# Altium schematic sheet Board-Power.SchDoc
size A3; SheetNumber: 7; SheetTotal: 9
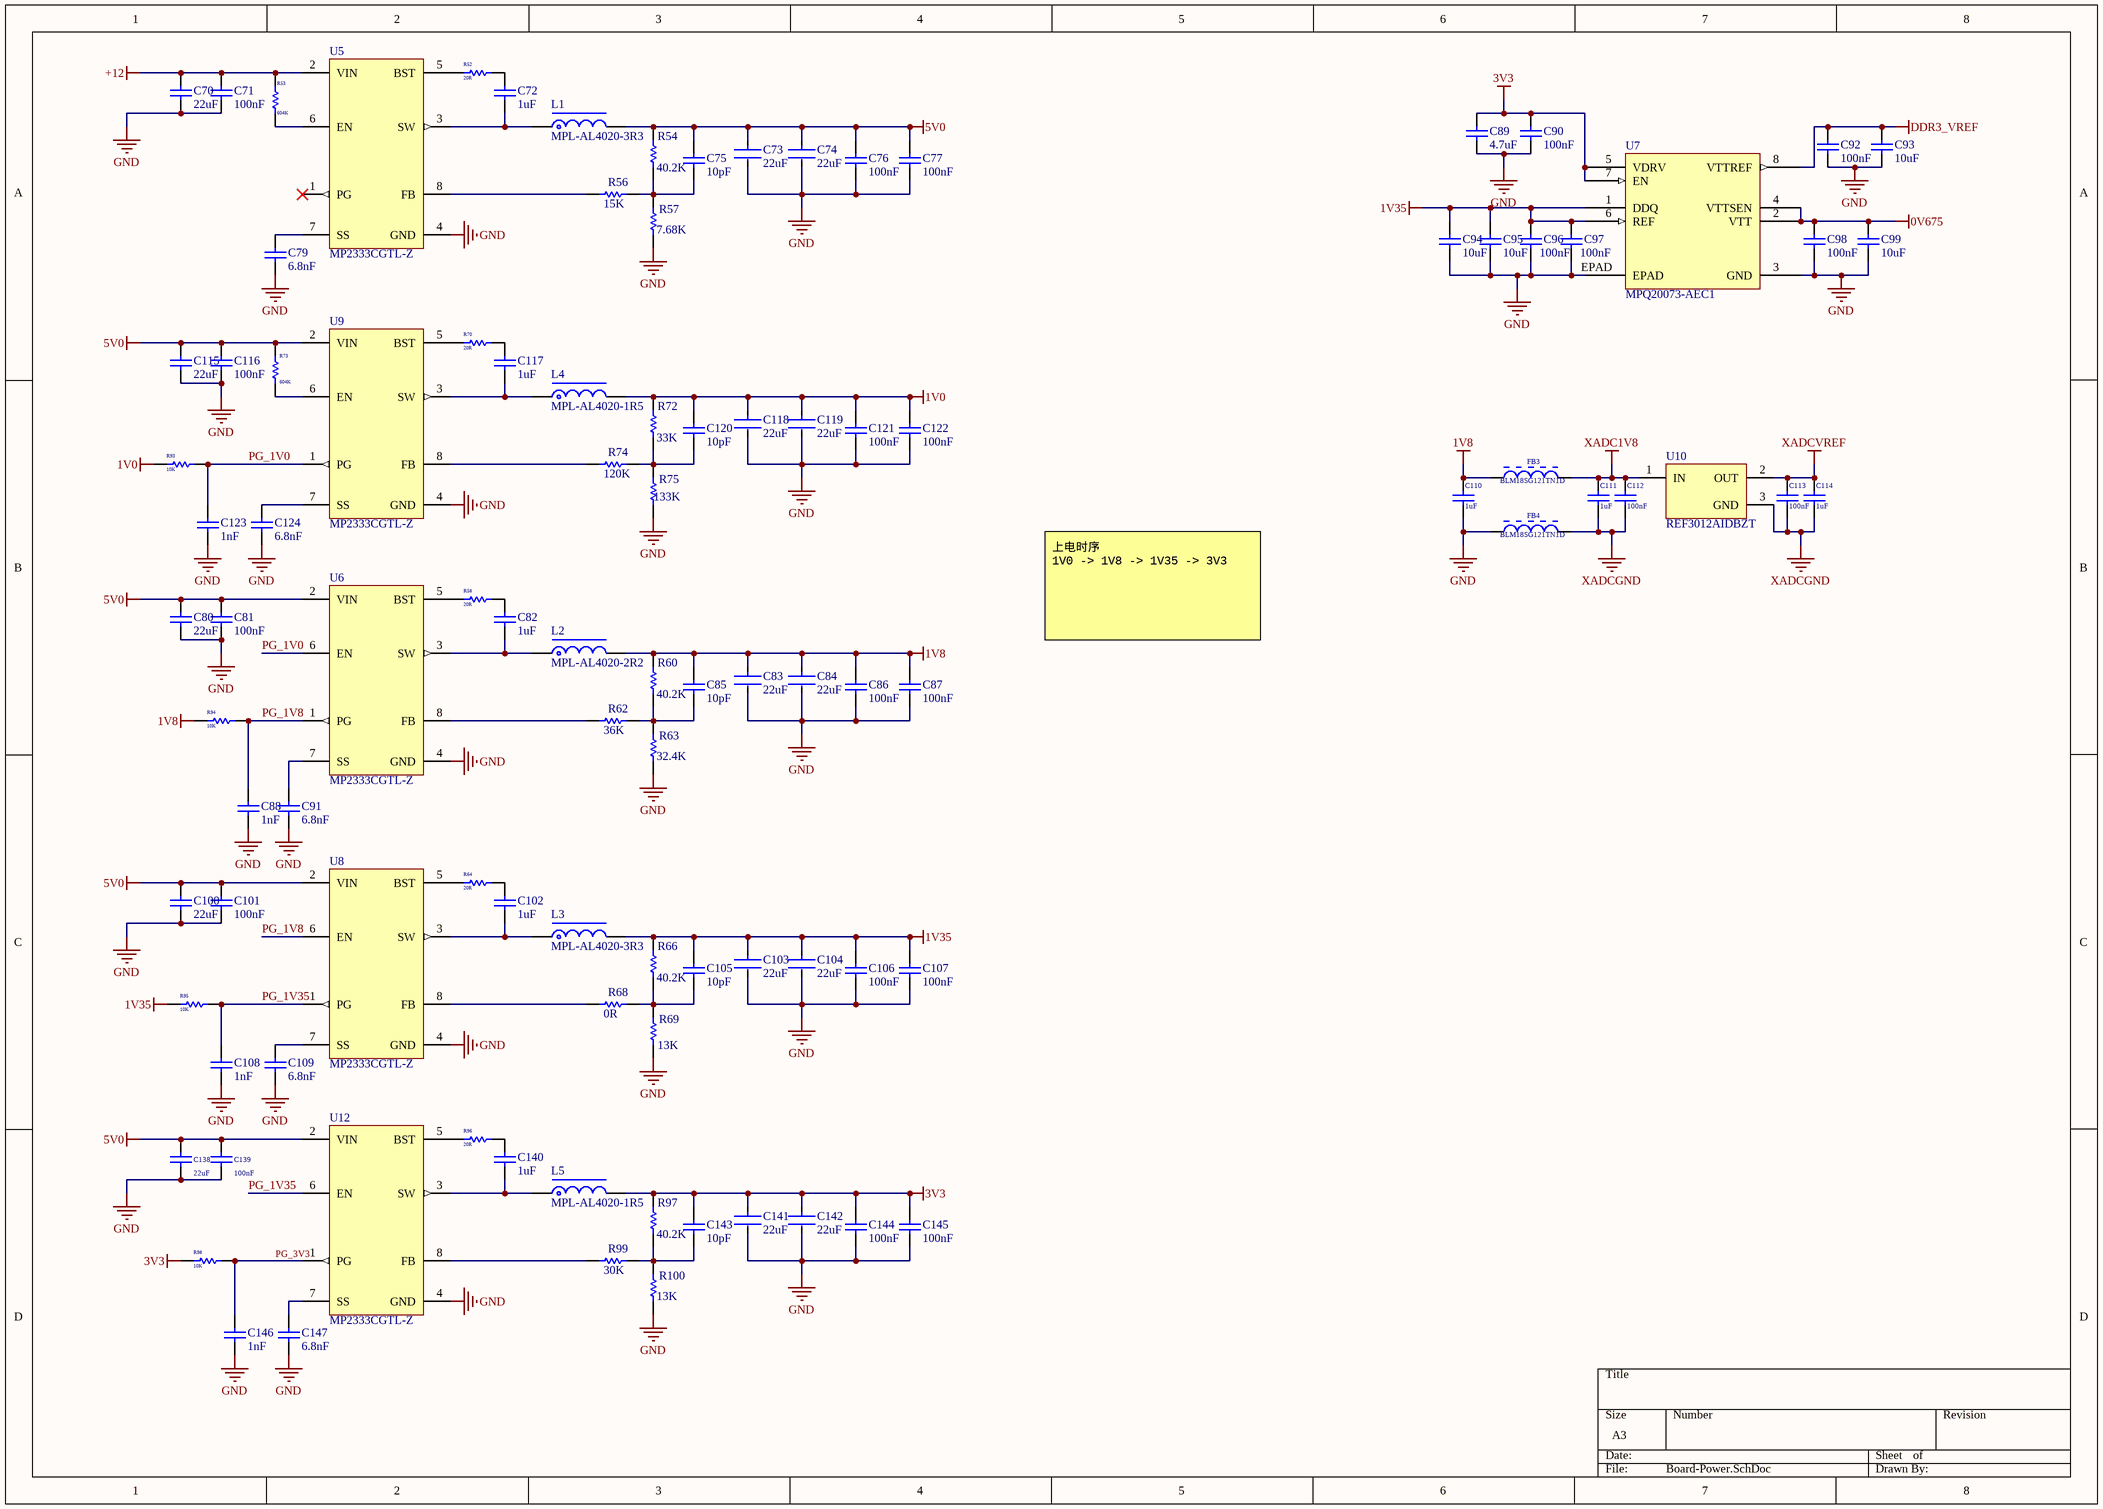
[diagram p0: Board-Power.SchDoc]

## Parts
C70  22uF  [CAPC2013X145X45LL20T25]
C71  100nF  [CAPC1005X55X25LL05T10]
C72  1uF  [CAPC1005X55X25LL05T10]
C73  22uF  [FP-GCM31C-0_2-e0_3_0_8-IPC_C]
C74  22uF  [FP-GCM31C-0_2-e0_3_0_8-IPC_C]
C75  10pF  [CAPC1005X55X25LL05T10]
C76  100nF  [CAPC1005X55X25LL05T10]
C77  100nF  [CAPC1005X55X25LL05T10]
C79  6.8nF  [CAPC1005X55X25LL05T10]
C80  22uF  [CAPC2013X145X45LL20T25]
C81  100nF  [CAPC1005X55X25LL05T10]
C82  1uF  [CAPC1005X55X25LL05T10]
C83  22uF  [FP-GCM31C-0_2-e0_3_0_8-IPC_C]
C84  22uF  [FP-GCM31C-0_2-e0_3_0_8-IPC_C]
C85  10pF  [CAPC1005X55X25LL05T10]
C86  100nF  [CAPC1005X55X25LL05T10]
C87  100nF  [CAPC1005X55X25LL05T10]
C88  1nF  [CAPC1005X55X25LL05T10]
C89  4.7uF  [CAPC1005X55X25LL05T10]
C90  100nF  [CAPC1005X55X25LL05T10]
C91  6.8nF  [CAPC1005X55X25LL05T10]
C92  100nF  [CAPC1005X55X25LL05T10]
C93  10uF  [MURA-1206_H_1.8_L]
C94  10uF  [MURA-1206_H_1.8_L]
C95  10uF  [MURA-1206_H_1.8_L]
C96  100nF  [CAPC1005X55X25LL05T10]
C97  100nF  [CAPC1005X55X25LL05T10]
C98  100nF  [CAPC1005X55X25LL05T10]
C99  10uF  [MURA-1206_H_1.8_L]
C100  22uF  [CAPC2013X145X45LL20T25]
C101  100nF  [CAPC1005X55X25LL05T10]
C102  1uF  [CAPC1005X55X25LL05T10]
C103  22uF  [FP-GCM31C-0_2-e0_3_0_8-IPC_C]
C104  22uF  [FP-GCM31C-0_2-e0_3_0_8-IPC_C]
C105  10pF  [CAPC1005X55X25LL05T10]
C106  100nF  [CAPC1005X55X25LL05T10]
C107  100nF  [CAPC1005X55X25LL05T10]
C108  1nF  [CAPC1005X55X25LL05T10]
C109  6.8nF  [CAPC1005X55X25LL05T10]
C110  1uF  [CAPC1005X55X25LL05T10]
C111  1uF  [CAPC1005X55X25LL05T10]
C112  100nF  [CAPC1005X55X25LL05T10]
C113  100nF  [CAPC1005X55X25LL05T10]
C114  1uF  [CAPC1005X55X25LL05T10]
C115  22uF  [CAPC2013X145X45LL20T25]
C116  100nF  [CAPC1005X55X25LL05T10]
C117  1uF  [CAPC1005X55X25LL05T10]
C118  22uF  [FP-GCM31C-0_2-e0_3_0_8-IPC_C]
C119  22uF  [FP-GCM31C-0_2-e0_3_0_8-IPC_C]
C120  10pF  [CAPC1005X55X25LL05T10]
C121  100nF  [CAPC1005X55X25LL05T10]
C122  100nF  [CAPC1005X55X25LL05T10]
C123  1nF  [CAPC1005X55X25LL05T10]
C124  6.8nF  [CAPC1005X55X25LL05T10]
C138  22uF  [CAPC2013X145X45LL20T25]
C139  100nF  [CAPC1005X55X25LL05T10]
C140  1uF  [CAPC1005X55X25LL05T10]
C141  22uF  [FP-GCM31C-0_2-e0_3_0_8-IPC_C]
C142  22uF  [FP-GCM31C-0_2-e0_3_0_8-IPC_C]
C143  10pF  [CAPC1005X55X25LL05T10]
C144  100nF  [CAPC1005X55X25LL05T10]
C145  100nF  [CAPC1005X55X25LL05T10]
C146  1nF  [CAPC1005X55X25LL05T10]
C147  6.8nF  [CAPC1005X55X25LL05T10]
FB3  BLM18SG121TN1D  [MURA-BLM18SG-B40-CHIP-2_V6]
FB4  BLM18SG121TN1D  [MURA-BLM18SG-B40-CHIP-2_V6]
L1  MPL-AL4020-3R3  [MPL-AL4020]
L2  MPL-AL4020-2R2  [MPL-AL4020]
L3  MPL-AL4020-3R3  [MPL-AL4020]
L4  MPL-AL4020-1R5  [MPL-AL4020]
L5  MPL-AL4020-1R5  [MPL-AL4020]
R52  20R  [RESC1005X40X25LL05T05]
R53  604K  [RESC1005X40X25LL05T05]
R54  40.2K  [RESC1005X40X25LL05T05]
R56  15K  [RESC1005X40X25LL05T05]
R57  7.68K  [RESC1005X40X25LL05T05]
R58  20R  [RESC1005X40X25LL05T05]
R60  40.2K  [RESC1005X40X25LL05T05]
R62  36K  [RESC1005X40X25LL05T05]
R63  32.4K  [RESC1005X40X25LL05T05]
R64  20R  [RESC1005X40X25LL05T05]
R66  40.2K  [RESC1005X40X25LL05T05]
R68  0R  [RESC1005X40X25LL05T05]
R69  13K  [RESC1005X40X25LL05T05]
R70  20R  [RESC1005X40X25LL05T05]
R72  33K  [RESC1005X40X25LL05T05]
R73  604K  [RESC1005X40X25LL05T05]
R74  120K  [RESC1005X40X25LL05T05]
R75  133K  [RESC1005X40X25LL05T05]
R93  10K  [RESC1005X40X25LL05T05]
R94  10K  [RESC1005X40X25LL05T05]
R95  10K  [RESC1005X40X25LL05T05]
R96  20R  [RESC1005X40X25LL05T05]
R97  40.2K  [RESC1005X40X25LL05T05]
R98  10K  [RESC1005X40X25LL05T05]
R99  30K  [RESC1005X40X25LL05T05]
R100  13K  [RESC1005X40X25LL05T05]
U5  MP2333CGTL-Z  [SOT583_MP2333C_MNP]
U6  MP2333CGTL-Z  [SOT583_MP2333C_MNP]
U7  MPQ20073-AEC1  [MSOP-8-EP_MNP-L]
U8  MP2333CGTL-Z  [SOT583_MP2333C_MNP]
U9  MP2333CGTL-Z  [SOT583_MP2333C_MNP]
U10  REF3012AIDBZT  [DBZ0003A_L]
U12  MP2333CGTL-Z  [SOT583_MP2333C_MNP]

## Nets
0V675: C98.2 C99.2 U7.2(VTT) U7.4(VTTSEN)
1V0: C118.1 C119.1 C120.2 C121.2 C122.2 L4.2 R72.1 R93.2
1V8: C83.1 C84.1 C85.2 C86.2 C87.2 C110.2 FB3.1 L2.2 R60.1 R94.2
1V35: C94.2 C95.2 C96.2 C97.2 C103.1 C104.1 C105.2 C106.2 C107.2 L3.2 R66.1 R95.2 U7.1(DDQ) U7.6(REF)
3V3: C89.2 C90.2 C141.1 C142.1 C143.2 C144.2 C145.2 L5.2 R97.1 R98.2 U7.5(VDRV) U7.7(EN)
5V0: C73.1 C74.1 C75.2 C76.2 C77.2 C80.2 C81.2 C100.2 C101.2 C115.2 C116.2 C138.2 C139.2 L1.2 R54.1 R73.2 U6.2(VIN) U8.2(VIN) U9.2(VIN) U12.2(VIN)
+12: C70.2 C71.2 R53.2 U5.2(VIN)
DDR3_VREF: C92.2 C93.2 U7.8(VTTREF)
GND: C70.1 C71.1 C73.2 C74.2 C76.1 C77.1 C79.2 C80.1 C81.1 C83.2 C84.2 C86.1 C87.1 C88.2 C89.1 C90.1 C91.2 C92.1 C93.1 C94.1 C95.1 C96.1 C97.1 C98.1 C99.1 C100.1 C101.1 C103.2 C104.2 C106.1 C107.1 C108.2 C109.2 C110.1 C115.1 C116.1 C118.2 C119.2 C121.1 C122.1 C123.2 C124.2 C138.1 C139.1 C141.2 C142.2 C144.1 C145.1 C146.2 C147.2 FB4.1 R57.2 R63.2 R69.2 R75.2 R100.2 U5.4(GND) U6.4(GND) U7.3(GND) U7.EPAD U8.4(GND) U9.4(GND) U12.4(GND)
XADC1V8: C111.2 C112.2 FB3.2 U10.1(IN)
XADCGND: C111.1 C112.1 C113.1 C114.1 FB4.2 U10.3(GND)
XADCVREF: C113.2 C114.2 U10.2(OUT)
PG_1V0: C123.1 R93.1 U6.6(EN) U9.1(PG)
PG_1V8: C88.1 R94.1 U6.1(PG) U8.6(EN)
PG_1V35: C108.1 R95.1 U8.1(PG) U12.6(EN)
PG_3V3: C146.1 R98.1 U12.1(PG)
NetC72_1: C72.1 L1.1 U5.3(SW)
NetC72_2: C72.2 R52.1
NetC75_1: C75.1 R54.2 R56.2 R57.1
NetC79_1: C79.1 U5.7(SS)
NetC82_1: C82.1 L2.1 U6.3(SW)
NetC82_2: C82.2 R58.1
NetC85_1: C85.1 R60.2 R62.2 R63.1
NetC91_1: C91.1 U6.7(SS)
NetC102_1: C102.1 L3.1 U8.3(SW)
NetC102_2: C102.2 R64.1
NetC105_1: C105.1 R66.2 R68.2 R69.1
NetC109_1: C109.1 U8.7(SS)
NetC117_1: C117.1 L4.1 U9.3(SW)
NetC117_2: C117.2 R70.1
NetC120_1: C120.1 R72.2 R74.2 R75.1
NetC124_1: C124.1 U9.7(SS)
NetC140_1: C140.1 L5.1 U12.3(SW)
NetC140_2: C140.2 R96.1
NetC143_1: C143.1 R97.2 R99.2 R100.1
NetC147_1: C147.1 U12.7(SS)
NetR52_2: R52.2 U5.5(BST)
NetR53_1: R53.1 U5.6(EN)
NetR56_1: R56.1 U5.8(FB)
NetR58_2: R58.2 U6.5(BST)
NetR62_1: R62.1 U6.8(FB)
NetR64_2: R64.2 U8.5(BST)
NetR68_1: R68.1 U8.8(FB)
NetR70_2: R70.2 U9.5(BST)
NetR73_1: R73.1 U9.6(EN)
NetR74_1: R74.1 U9.8(FB)
NetR96_2: R96.2 U12.5(BST)
NetR99_1: R99.1 U12.8(FB)

Not connected (* = marked no-connect by the designer): U5 1(PG)*

## Notes on the sheet
- 上电时序
  1V0 -> 1V8 -> 1V35 -> 3V3

## Library data of the parts
C70 C80 C100 C115 C138 = CMP-2007-03222-1: GRM21BR61E226ME44L; Manufacturer: Murata; Part Number: GRM21BR61E226ME44L
C71 C72 C75-C77 C79 C81 C82 C85-C92 C96-C98 C101 C102 C105-C114 C116 C117 C120-C124 C139 C140 C143-C147 = CMP-2008-04639-1: Part Number: GRM155R71H104KE14D; Manufacturer: Murata
C73 C74 C83 C84 C103 C104 C118 C119 C141 C142 = CMP-00080-1: GCM31CR71A226KE02K / Cap, Aec-Q200, 22Uf, 10V, Mlcc, 1206 Rohs Compliant: Yes; RoHS Compliant: Yes
C93-C95 C99 = CMP-2000-05256-1: GRM31CR61H106KA12L / CAP, Ceramic, 10 uF, 10%, 50 V, 1206, RoHS, Tape and Reel; Manufacturer: Murata; Dielectric: X5R; Case Height: 1.6mm; Type: GeneralPurposeMLCC; Voltage Rating DC: 50V; Brand: MurataElectronics; Case Length: 3.2mm; Case Code - mm: 3216; Manufacturer URL: http://www.murata.com/; Product: GeneralTypeMLCCs; RoHS: Details; Minimum Operating Temperature: -55C; Factory Pack Quantity: 2000; Maximum Operating Temperature: +85C; Case Width: 1.6mm; Series: GRM; Package / Case: 1206(3216metric); Tolerance: 10%; Capacitance: 10uF; Datasheet URL: http://download.siliconexpert.com/pdfs/2015/11/6/15/23/32/328/mrt_/manual/2905595417290350grm31cr61h106ka1223.pdf; Product Category: MultilayerCeramicCapacitorsMLCC-SMD/SMT; Packaging: Reel; Termination Style: SMD/SMT; Datasheet Version: Nov-15; Case Code - in: 1206
FB3 FB4 = CMP-0686-00602-3: Chip Ferrite Bead for Power Lines (Low DC Resistance Type), 120 Ohm, 3000 mA, -55 to 125 degC, 1.6 x 0.8 x 0.65 mm SMD, Tape and Reel; Manufacturer: Murata; Impedance (at 100 MHz): 120 Ohm +/- 25%; Rated Current: 3000 mA; DC Resistance: 0.025 Ohm Max.; ComponentLink3Description: Package Specification; PackageReference: BLM18_H650-2; DatasheetVersion: 08/2013; Packing: Tape and Reel; PartNumber: BLM18SG121TN1D; PackageDescription: 2-Pin Chip, Body 1.6 x 0.8 mm; ComponentLink2Description: Datasheet; ComponentLink3URL: http://www.murata.com/products/catalog/pdf/c31e.pdf; ComponentLink1URL: http://www.murata.com/; Operating Temperature Range: -55 to 125 degC; Mounting Technology: Surface Mount; ComponentLink2URL: http://www.murata.com/products/catalog/pdf/c31e.pdf; ComponentLink1Description: Manufacturer URL
L1-L5 = L-Molding Choke: 一体成型电感; 当前库版本V2023.5.31 @淘宝卖家:黄晶宝石: 最新版本发布https://item.taobao.com/item.htm?id=566775463719; BOM名称: 一体成型电感
R52-R54 R56-R58 R60 R62-R64 R66 R68-R70 R72-R75 R93-R100 = CMP-2002-00921-1: Manufacturer: Panasonic; Part Number: ERJ-2RKF40R2X
U5 U6 U8 U9 U12 = CMP-00056-5: Switching Voltage Regulators 3A, 18V, 650kHz, Force CCM, Synchronous Step-Down C
U7 = CMP-00079-2: 2A 1.3V–6.0V DDR Memory Termination Regulator AEC-Q100 Qualified
U10 = CMP-0367-00158-2: 1.25 V, 50 ppm / degC, 50 uA Series (Bandgap) Voltage Reference, -40 to 125 degC, 3-pin SOT-23 (DBZ), Green (RoHS & no Sb/Br); Manufacturer: Texas Instruments; Iq(Max)(uA): 50; Initial Accuracy @ 25/deg C(%): 0.2; Rating: Catalog; VI(Max)(V): 5.5; VI(Min)(V): 1.8; Temp Coeff(Typ)(ppm/ degree C): 20; SubFamily: Series Voltage Reference; VO(V): 1.25; ComponentLink1Description: Manufacturer URL; ComponentLink1URL: http://www.ti.com/; PartNumber: REF3012AIDBZT; PackageDescription: 3-Pin Plastic Small Outline, Body 2.92 x 1.3 mm, Pitch 0.95 mm; Mounting Technology: Surface Mount; Eco-Plan: Green (RoHS & no Sb/Br); PackageVersion: 4203227/B; ComponentLink2URL: http://www.ti.com/general/docs/lit/getliterature.tsp?genericPartNumber=REF3012&fileType=pdf; ComponentLink2Description: Datasheet; Temp Coeff(Max)(ppm/ degree C): 50; Code_JEDEC: TO-236; PackageReference: DBZ0003A; ComponentLink3Description: Package Specification; DatasheetVersion: SBVS032F; ComponentLink3URL: http://www.ti.com/litv/pdf/mpds108a